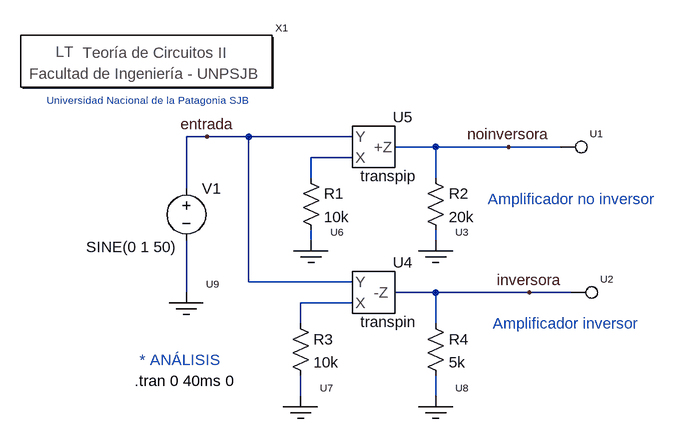
[diagram p0: schematic Amplificadores no inversor e inversor con transferidores.asc]
Amplificadores no inversor e inversor con transferidores.asc, the LTspice schematic file:
Version 4
SHEET 1 880 680
WIRE -16 16 -48 16
WIRE 48 16 -16 16
WIRE 208 16 48 16
WIRE 336 32 272 32
WIRE 448 32 336 32
WIRE 528 32 448 32
WIRE 208 48 144 48
WIRE 144 80 144 48
WIRE 336 80 336 32
WIRE -48 96 -48 16
WIRE 144 176 144 160
WIRE 336 176 336 160
WIRE 48 240 48 16
WIRE 208 240 48 240
WIRE -48 256 -48 176
WIRE 336 256 272 256
WIRE 480 256 336 256
WIRE 544 256 480 256
WIRE 208 272 128 272
WIRE 128 304 128 272
WIRE 336 304 336 256
WIRE 128 416 128 384
WIRE 336 416 336 384
FLAG 480 256 inversora
FLAG -16 16 entrada
FLAG 448 32 noinversora
SYMBOL res 128 64 R0
SYMATTR InstName R1
SYMATTR Value 10k
SYMBOL res 320 64 R0
SYMATTR InstName R2
SYMATTR Value 20k
SYMBOL res 112 288 R0
SYMATTR InstName R3
SYMATTR Value 10k
SYMBOL res 320 288 R0
SYMATTR InstName R4
SYMATTR Value 5k
SYMBOL voltage -48 80 R0
WINDOW 3 -154 106 Left 2
WINDOW 123 0 0 Left 2
WINDOW 39 0 0 Left 2
SYMATTR Value SINE(0 1 50)
SYMATTR InstName V1
SYMBOL Circuitos2\\Letreros\\Teoría\ de\ Circuitos\ II -112 -96 R0
SYMATTR InstName X1
SYMBOL Circuitos2\\ComponentesIdeales\\transpin 240 192 R0
SYMATTR InstName U4
SYMBOL Circuitos2\\ComponentesIdeales\\transpip 240 -32 R0
SYMATTR InstName U5
SYMBOL Circuitos2\\Borneras\\Bubble 560 256 R0
SYMATTR InstName U2
SYMBOL Circuitos2\\Borneras\\Borne 544 32 R0
SYMATTR InstName U1
SYMBOL Circuitos2\\Fuentes\\masa 336 192 R0
SYMATTR InstName U3
SYMBOL Circuitos2\\Fuentes\\masa 144 192 R0
SYMATTR InstName U6
SYMBOL Circuitos2\\Fuentes\\masa 128 432 R0
SYMATTR InstName U7
SYMBOL Circuitos2\\Fuentes\\masa 336 432 R0
SYMATTR InstName U8
SYMBOL Circuitos2\\Fuentes\\masa -48 272 R0
SYMATTR InstName U9
TEXT -128 392 Left 2 !.tran 0 40ms 0
TEXT 416 112 Left 2 ;Amplificador no inversor
TEXT 424 304 Left 2 ;Amplificador inversor
TEXT -120 360 Left 2 ;* ANÁLISIS
TEXT -112 -40 Center 1 ;Universidad Nacional de la Patagonia SJB

The netlist it stands for:
* Amplificadores no inversor e inversor con transferidores.asc
R1 N001 N002 10k
R2 noinversora N003 20k
R3 N005 N006 10k
R4 inversora N007 5k
V1 entrada N004 SINE(0 1 50)
XX1 Teoría de Circuitos II
XU4 entrada N005 inversora transpin  ; pins Y X Z
XU5 entrada N001 noinversora transpip  ; pins Y X Z
XU2 inversora borne  ; pins 1
XU1 noinversora borne  ; pins 1
XU3 N003 masa masa  ; pins 1
XU6 N002 masa masa  ; pins 1
XU7 N006 masa masa  ; pins 1
XU8 N007 masa masa  ; pins 1
XU9 N004 masa masa  ; pins 1
.tran 0 40ms 0
* Amplificador no inversor
* Amplificador inversor
* * ANÁLISIS
* Universidad Nacional de la Patagonia SJB
.lib ..\sym\Circuitos2\ComponentesIdeales\compoideales.lib
.lib ..\sym\Circuitos2\Borneras\borne.lib
.lib ..\sym\Circuitos2\Fuentes\Fuentes.lib
.backanno
.end